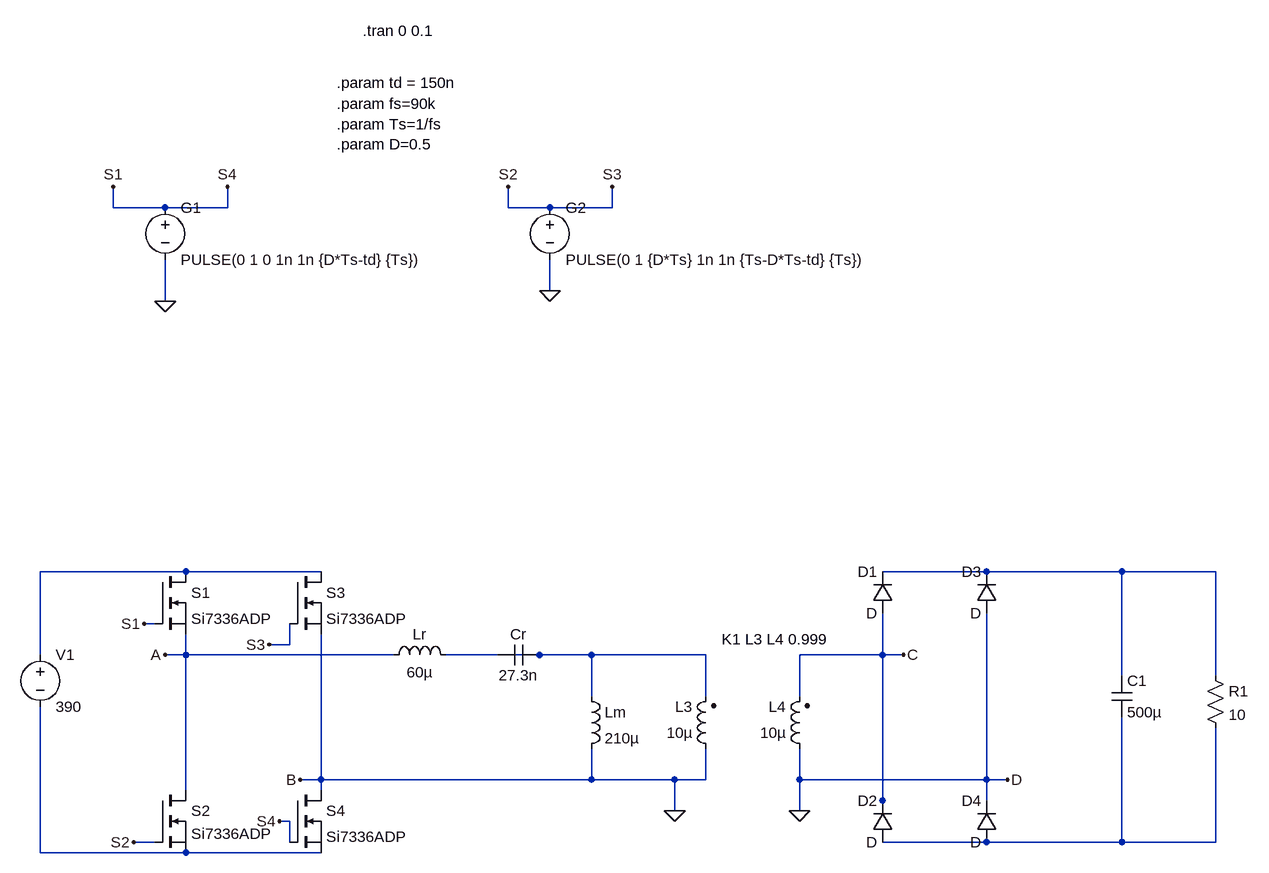
[diagram p0: schematic FB_LLC_Ti.asc]
FB_LLC_Ti.asc, the LTspice schematic file:
Version 4
SHEET 1 1816 680
WIRE 64 -544 64 -576
WIRE 144 -544 64 -544
WIRE 240 -544 240 -576
WIRE 240 -544 144 -544
WIRE 672 -544 672 -576
WIRE 736 -544 672 -544
WIRE 832 -544 832 -576
WIRE 832 -544 736 -544
WIRE 736 -416 736 -464
WIRE 144 -400 144 -464
WIRE 176 16 -48 16
WIRE 384 16 176 16
WIRE 1408 16 1248 16
WIRE 1616 16 1408 16
WIRE 1760 16 1616 16
WIRE 128 96 112 96
WIRE 336 128 336 96
WIRE 336 128 304 128
WIRE -48 144 -48 16
WIRE 176 144 176 112
WIRE 176 144 144 144
WIRE 496 144 176 144
WIRE 656 144 576 144
WIRE 720 144 672 144
WIRE 800 144 720 144
WIRE 976 144 800 144
WIRE 1248 144 1248 80
WIRE 1248 144 1120 144
WIRE 1280 144 1248 144
WIRE 1616 176 1616 16
WIRE 1760 176 1760 16
WIRE 800 208 800 144
WIRE 976 208 976 144
WIRE 1120 208 1120 144
WIRE 384 336 384 112
WIRE 384 336 352 336
WIRE 800 336 800 288
WIRE 800 336 384 336
WIRE 928 336 800 336
WIRE 976 336 976 288
WIRE 976 336 928 336
WIRE 1120 336 1120 288
WIRE 1408 336 1408 80
WIRE 1408 336 1120 336
WIRE 1440 336 1408 336
WIRE 176 352 176 144
WIRE 384 352 384 336
WIRE 1248 368 1248 144
WIRE 1408 368 1408 336
WIRE 928 384 928 336
WIRE 1120 384 1120 336
WIRE 1248 384 1248 368
WIRE 336 400 320 400
WIRE 128 432 96 432
WIRE 336 432 336 400
WIRE 1408 432 1248 432
WIRE 1616 432 1616 240
WIRE 1616 432 1408 432
WIRE 1760 432 1760 256
WIRE 1760 432 1616 432
WIRE -48 448 -48 224
WIRE 176 448 -48 448
WIRE 384 448 176 448
FLAG 144 144 A
FLAG 352 336 B
FLAG 1280 144 C
FLAG 1440 336 D
FLAG 144 -400 0
FLAG 736 -416 0
FLAG 64 -576 S1
FLAG 240 -576 S4
FLAG 672 -576 S2
FLAG 832 -576 S3
FLAG 112 96 S1
FLAG 304 128 S3
FLAG 320 400 S4
FLAG 96 432 S2
FLAG 928 384 0
FLAG 1120 384 0
SYMBOL voltage -48 128 R0
WINDOW 123 0 0 Left 0
WINDOW 39 0 0 Left 0
SYMATTR InstName V1
SYMATTR Value 390
SYMBOL nmos 128 16 R0
SYMATTR InstName S1
SYMATTR Value Si7336ADP
SYMBOL nmos 128 352 R0
WINDOW 3 56 67 Left 2
SYMATTR Value Si7336ADP
SYMATTR InstName S2
SYMBOL nmos 336 16 R0
SYMATTR InstName S3
SYMATTR Value Si7336ADP
SYMBOL nmos 336 352 R0
SYMATTR InstName S4
SYMATTR Value Si7336ADP
SYMBOL ind 480 160 R270
WINDOW 0 32 56 VTop 2
WINDOW 3 5 56 VBottom 2
SYMATTR InstName Lr
SYMATTR Value 60µ
SYMBOL ind 784 192 R0
SYMATTR InstName Lm
SYMATTR Value 210µ
SYMBOL ind2 992 304 R180
WINDOW 0 36 80 Left 2
WINDOW 3 36 40 Left 2
SYMATTR InstName L3
SYMATTR Value 10µ
SYMATTR Type ind
SYMBOL ind2 1136 304 R180
WINDOW 0 36 80 Left 2
WINDOW 3 36 40 Left 2
SYMATTR InstName L4
SYMATTR Value 10µ
SYMATTR Type ind
SYMBOL diode 1264 80 R180
WINDOW 0 24 64 Left 2
WINDOW 3 24 0 Left 2
SYMATTR InstName D1
SYMBOL diode 1264 432 R180
WINDOW 0 24 64 Left 2
WINDOW 3 24 0 Left 2
SYMATTR InstName D2
SYMBOL diode 1424 80 R180
WINDOW 0 24 64 Left 2
WINDOW 3 24 0 Left 2
SYMATTR InstName D3
SYMBOL diode 1424 432 R180
WINDOW 0 24 64 Left 2
WINDOW 3 24 0 Left 2
SYMATTR InstName D4
SYMBOL cap 1600 176 R0
SYMATTR InstName C1
SYMATTR Value 500µ
SYMBOL res 1744 160 R0
SYMATTR InstName R1
SYMATTR Value 10
SYMBOL cap 656 160 R270
WINDOW 0 32 32 VTop 2
WINDOW 3 0 32 VBottom 2
SYMATTR InstName Cr
SYMATTR Value 27.3n
SYMBOL voltage 144 -560 R0
WINDOW 123 0 0 Left 0
WINDOW 39 0 0 Left 0
SYMATTR InstName G1
SYMATTR Value PULSE(0 1 0 1n 1n {D*Ts-td} {Ts})
SYMBOL voltage 736 -560 R0
WINDOW 123 0 0 Left 0
WINDOW 39 0 0 Left 0
SYMATTR InstName G2
SYMATTR Value PULSE(0 1 {D*Ts} 1n 1n {Ts-D*Ts-td} {Ts})
TEXT 408 -704 Left 2 !.param fs=90k\n.param Ts=1/fs\n.param D=0.5
TEXT 408 -736 Left 2 !.param td = 150n
TEXT 448 -816 Left 2 !.tran 0 0.1
TEXT 1000 120 Left 2 !K1 L3 L4 0.999

The netlist it stands for:
* FB_LLC_Ti.asc
V1 N001 N006 390
M§S1 N001 S4 A A Si7336ADP
M§S2 A S3 N006 N006 Si7336ADP
M§S3 N001 S3 0 0 Si7336ADP
M§S4 0 S4 N006 N006 Si7336ADP
Lr A N003 60µ
Lm N004 0 210µ
L3 0 N004 10µ
L4 0 C 10µ
D1 C N002 D
D2 N005 C D
D3 0 N002 D
D4 N005 0 D
C1 N002 N005 500µ
R1 N002 N005 10
Cr N003 N004 27.3n
V§G1 S4 0 PULSE(0 1 0 1n 1n {D*Ts-td} {Ts})
V§G2 S3 0 PULSE(0 1 {D*Ts} 1n 1n {Ts-D*Ts-td} {Ts})
.model D D
.lib standard.dio
.model NMOS NMOS
.model PMOS PMOS
.lib standard.mos
.param fs=90k
.param Ts=1/fs
.param D=0.5
.param td = 150n
.tran 0 0.1
K1 L3 L4 0.999
.backanno
.end